# EasyEDA schematic oLoRa-part-MainMCU.json
TITLE: oLoRa-part-MainMCU; REV: 1.0; Date: 2019-08-19; Sheet: 1/1; Drawn By: 김석현; Company: RMTEC
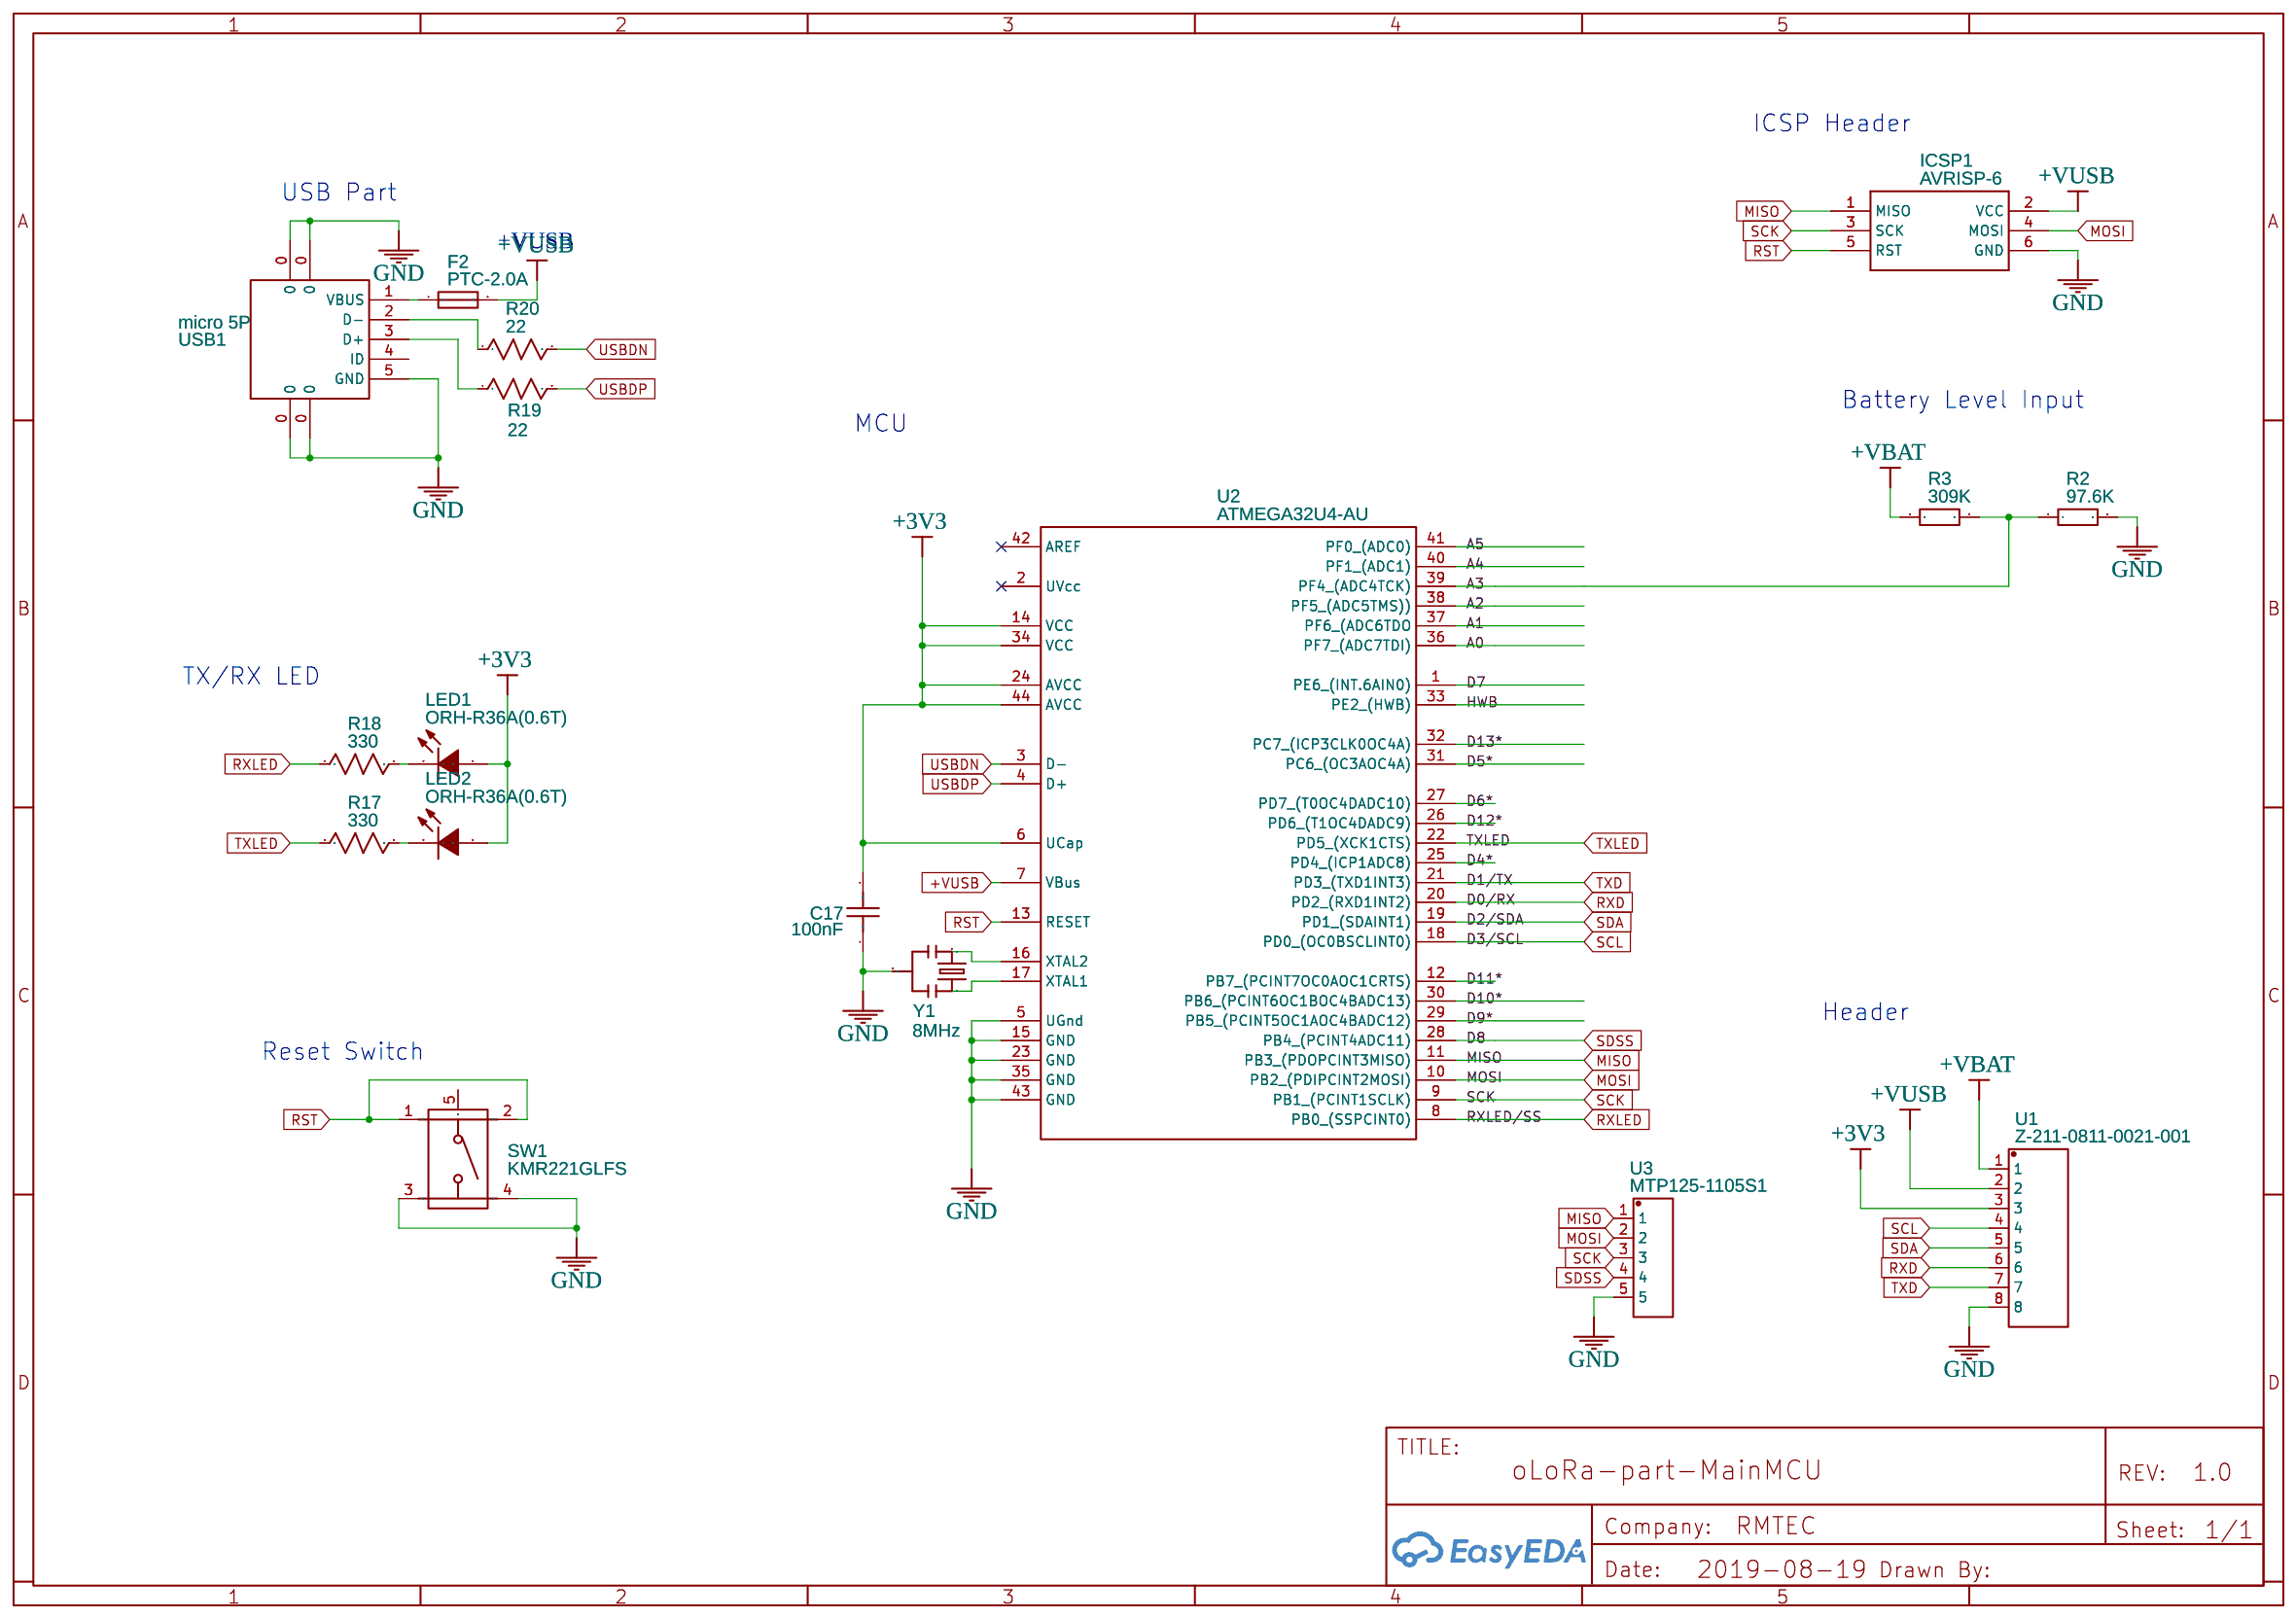
[diagram p0: schematic sheet]

## Parts
C17  100nF  [0603]
F2  PTC-2.0A  [1812]
ICSP1  AVRISP-6  [AVRISP]
LED1  ORH-R36A(0.6T)  [LED-0603]
LED2  ORH-R36A(0.6T)  [LED-0603]
R2  97.6K  [0603]
R3  309K  [0603]
R17  330  [0603]
R18  330  [0603]
R19  22  [0603]
R20  22  [0603]
SW1  KMR221GLFS  [KEY-SMD-4.6X2.8X1.9]
U1  Z-211-0811-0021-001  [SIP-2.54MM-8P-CJT-H8.54]
U2  ATMEGA32U4-AU  [QFP-44_10X10X08P]
U3  MTP125-1105S1  [SDIP-D-5_2.54]
USB1  micro 5P  [MICRO-USB-17]
Y1  8MHz  [X3-SMD-3.6X1.3X0.8MM]

## Library data of the parts
C17 = CC0603KRX7R9BB104: Supplier: LCSC; Manufacturer: YAGEO; LCSC Assembly: Yes; Supplier Part: C14663; SMT Type: Basic
F2 = -: Supplier: LCSC; Supplier Part: C210837; Manufacturer: BOURNS; Manufacturer Part: MF-MSMF200-2; Contributor: LCSC
ICSP1 = -: AVR ISP HEADER; Contributor: Adafruit; Manufacturer Part: ?
LED1 LED2 = -: Supplier: LCSC; Supplier Part: C205445; Manufacturer: Orient; Contributor: LCSC
R2 = CR0603-FX-9762ELF: Supplier: LCSC; Supplier Part: C203901; Manufacturer: BOURNS; Contributor: LCSC
R3 = 0603WAF3093T5E: Supplier: LCSC; Manufacturer: UniOhm; Supplier Part: C23001; LCSC Assembly: Yes; SMT Type: Extend
R17-R20 = Res_0603(1/10W)_US
SW1 = -: Supplier: LCSC; Supplier Part: C72443; Manufacturer: C&K; Contributor: LCSC
U1 = -: Supplier: LCSC; Supplier Part: C190820; Manufacturer: Nextronics Engineering; Contributor: LCSC
U2 = -: Supplier: LCSC; Manufacturer: MICROCHIP; image: //image.lceda.cn/szlcsc/C44854.jpg; Supplier Part: C44854; LCSC Assembly: Yes; SMT Type: Extend
U3 = -: Supplier: LCSC; Supplier Part: C358687; Manufacturer: MINTRON; Contributor: LCSC
USB1 = -: Supplier: LCSC; Supplier Part: C77238; Manufacturer: LCSC; Contributor: LCSC
Y1 = -: SMD Resonator 8MHz-33pF-0.1%;; Manufacturer Part: CSTCE8M00G55-R0

## Nets
+3V3: C17.2 LED1.1(A) LED2.1(A) U1.3 U2.6(UCap) U2.14(VCC) U2.24(AVCC) U2.34(VCC) U2.44(AVCC)
+VBAT: R3.1 U1.1
GND: C17.1 ICSP1.6(GND) R2.2 SW1.3 SW1.4 U1.8 U2.5(UGnd) U2.15(GND) U2.23(GND) U2.35(GND) U2.43(GND) U3.5 USB1.0 USB1.5(GND) Y1.2
+VUSB: F2.2 ICSP1.2(VCC) U1.2 U2.7(VBus)
A0: U2.36(PF7 (ADC7TDI))
A1: U2.37(PF6 (ADC6TDO)
A2: U2.38(PF5 (ADC5TMS)))
A3: R2.1 R3.2 U2.39(PF4 (ADC4TCK))
A4: U2.40(PF1 (ADC1))
A5: U2.41(PF0 (ADC0))
D0/RX: U1.6 U2.20(PD2 (RXD1INT2))
D1/TX: U1.7 U2.21(PD3 (TXD1INT3))
D2/SDA: U1.5 U2.19(PD1 (SDAINT1))
D3/SCL: U1.4 U2.18(PD0 (OC0BSCLINT0))
D4*: U2.25(PD4 (ICP1ADC8))
D5*: U2.31(PC6 (OC3AOC4A))
D6*: U2.27(PD7 (T0OC4DADC10))
D7: U2.1(PE6 (INT.6AIN0))
D8: U2.28(PB4 (PCINT4ADC11)) U3.4
D9*: U2.29(PB5 (PCINT5OC1AOC4BADC12))
D10*: U2.30(PB6 (PCINT6OC1BOC4BADC13))
D11*: U2.12(PB7 (PCINT7OC0AOC1CRTS))
D12*: U2.26(PD6 (T1OC4DADC9))
D13*: U2.32(PC7 (ICP3CLK0OC4A))
HWB: U2.33(PE2 (HWB))
MISO: ICSP1.1(MISO) U2.11(PB3 (PDOPCINT3MISO)) U3.1
MOSI: ICSP1.4(MOSI) U2.10(PB2 (PDIPCINT2MOSI)) U3.2
RST: ICSP1.5(RST) SW1.1 SW1.2 U2.13(RESET)
RXLED: R18.1 U2.8(PB0 (SSPCINT0))
SCK: ICSP1.3(SCK) U2.9(PB1 (PCINT1SCLK)) U3.3
TXLED: R17.1 U2.22(PD5 (XCK1CTS))
USBDN: R20.2 U2.3(D-)
USBDP: R19.2 U2.4(D+)
Net-(F2-1): F2.1 USB1.1(VBUS)
Net-(LED1-2): LED1.2(K) R18.2
Net-(LED2-2): LED2.2(K) R17.2
Net-(R19-1): R19.1 USB1.3(D+)
Net-(R20-1): R20.1 USB1.2(D-)
Net-(U2-16): U2.16(XTAL2) Y1.1
Net-(U2-17): U2.17(XTAL1) Y1.3

Not connected (* = marked no-connect by the designer): SW1 5; U2 2(UVcc)* 42(AREF)*; USB1 4(ID)

## Notes on the sheet
- ICSP Header
- USB Part
- +VUSB
- Battery Level Input
- MCU
- TX/RX LED
- Header
- Reset Switch
